# EAGLE board v3 (EAGLE 9.6.2)
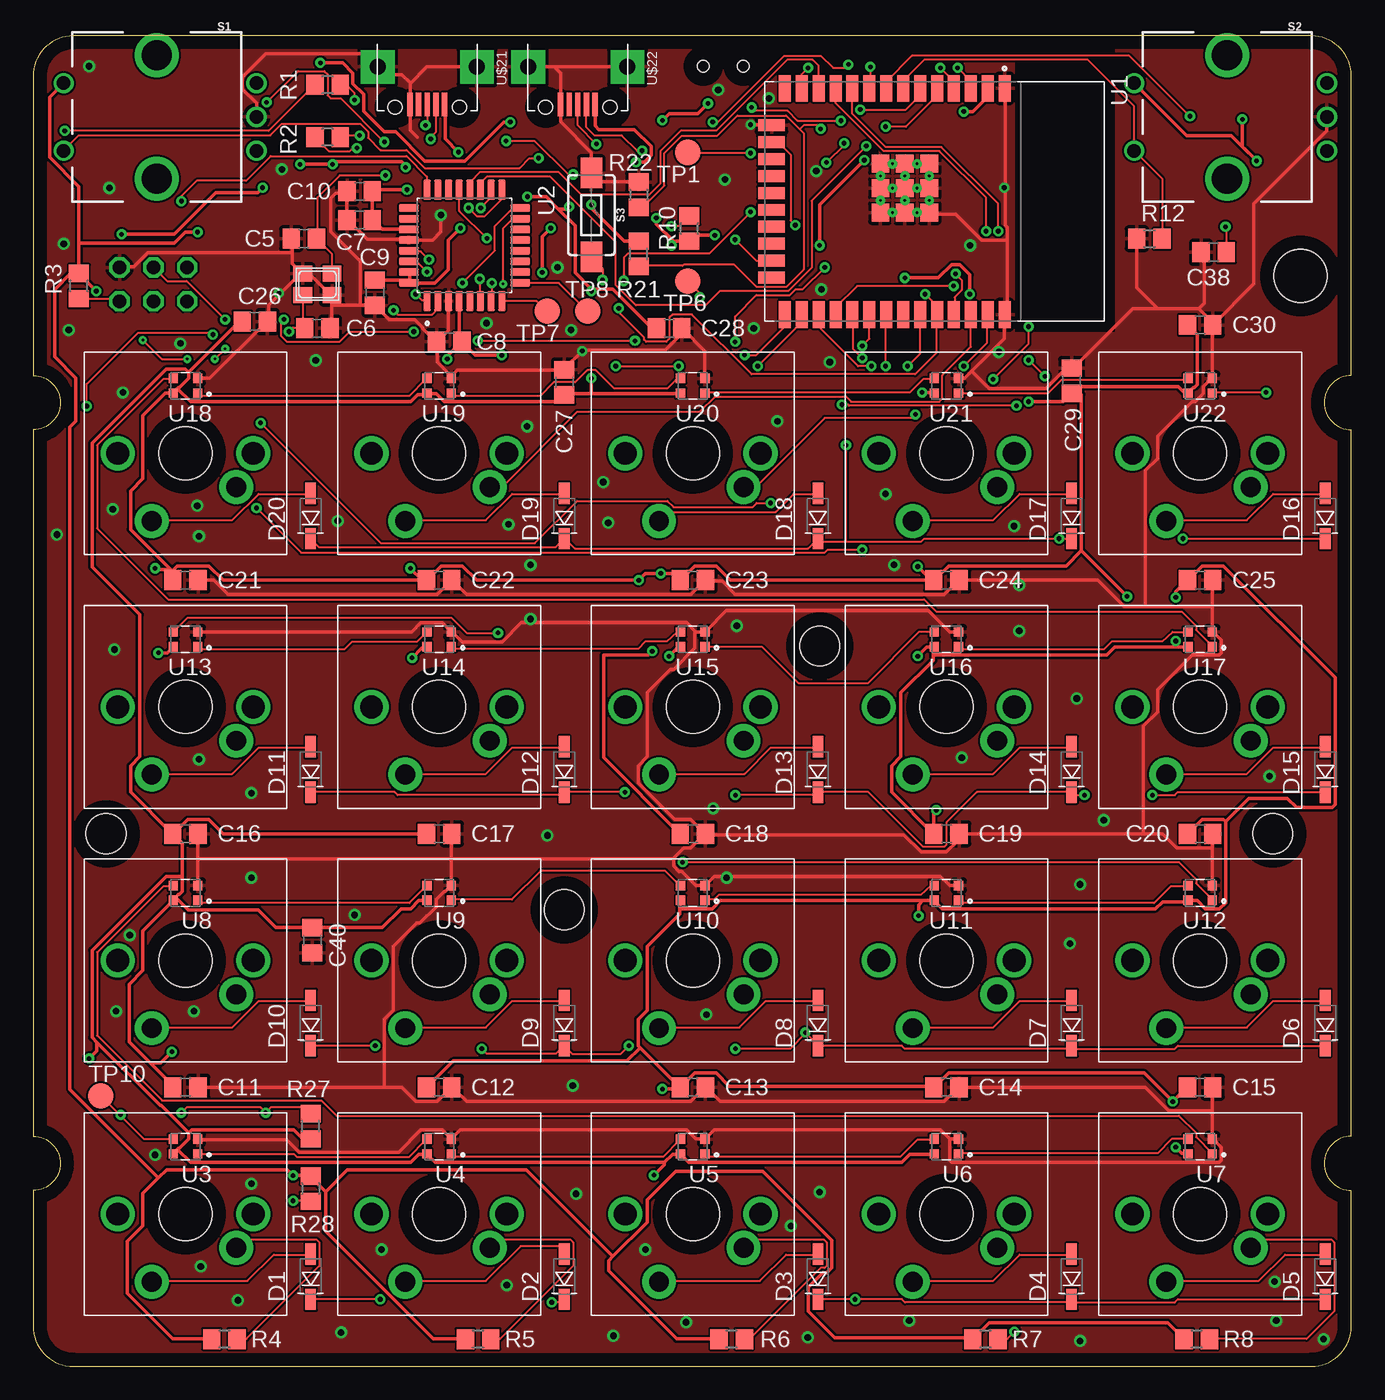
[diagram p1: board, top side]
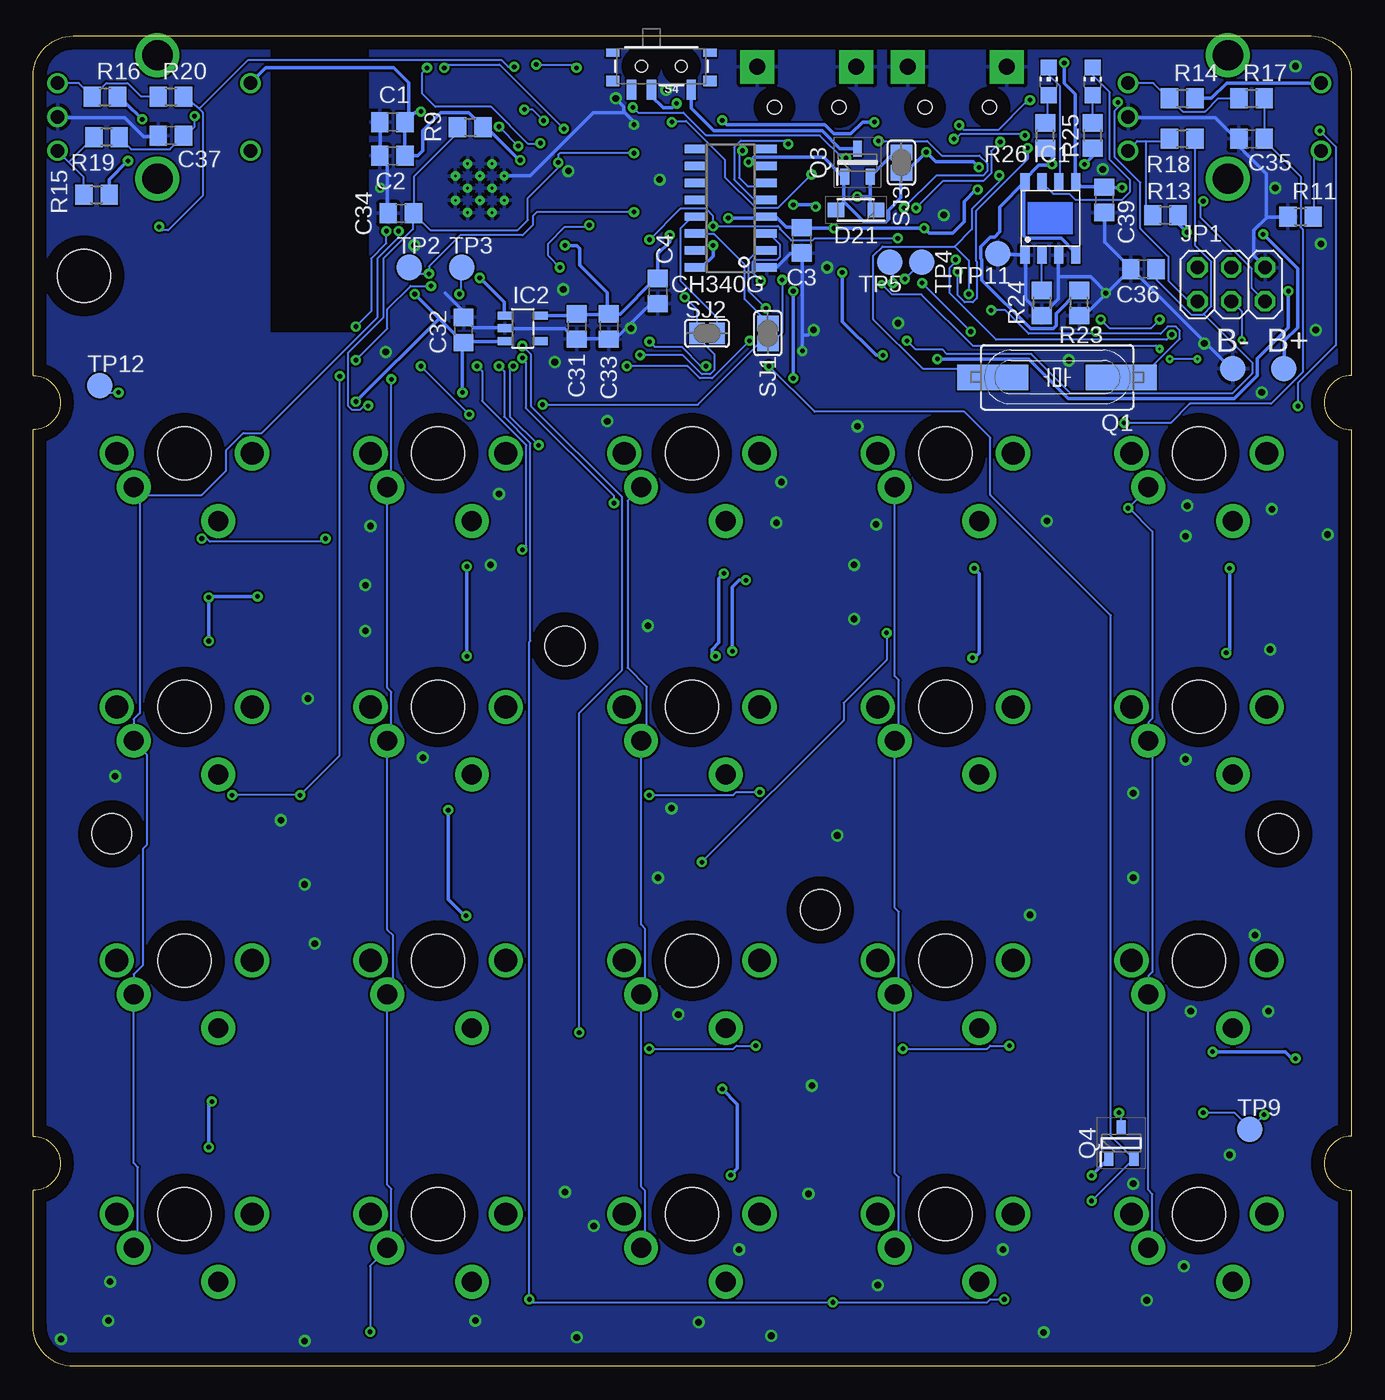
[diagram p2: board, bottom side, seen from below]

Size 98.98 x 99.94 mm. Coordinates in mm from the lower left corner, seen from the top.
Outline: 95.98,99.94 3,99.94 arc90 0,96.94 0,74.42 arc-180 0,70.36 0,17.27 arc-180 0,13.21 0,3 arc90 3,0 95.98,0 arc90 98.98,3 98.98,13.21 arc-180 98.98,17.27 98.98,70.36 arc-180 98.98,74.42 98.98,96.94 arc90 95.98,99.94
Copper layers (1*16): Top 0.035mm / dielectric 0.15mm / Bottom 0.035mm
Design rules "default *": minimum track width 6mil, minimum drill 0.2mm, track to track 6mil, track to pad 6mil, pad to pad 6mil, via to via 6mil, smd to smd 6mil, copper to edge 40mil, drill to drill 10mil, minimum pad ring 10mil, minimum via ring 8mil, stop-mask expansion 4mil, vias tented up to drill 0mil, thermal gap 10mil
Net classes: 1 pwr: width 0.279 mm
Holes 3 mm at 39.88,34.29 59.05,54.1 5.46,40.01 93.09,40.01
Holes 4 mm at 95.17,81.92

## Footprints (pad centres in the part's own frame; a part is rotated, then mirrored left to right if it is on the bottom)
C0805 = smd 1.3 x 1.5: 1 -0.95,0; 2 0.95,0
SOD123 = smd 1.6 x 0.8: 1 -1.7,0; 2 1.7,0
SODFL3616X98N = smd 1.24 x 1.12: 1 -1.5,0; 2 1.5,0
SOP-8 = smd 1.3 x 0.7: 1 -2.75,1.905; 2 -2.75,0.635; 3 -2.75,-0.635; 4 -2.75,-1.905; 5 2.75,-1.905; 6 2.75,-0.635; 7 2.75,0.635; 8 2.75,1.905
SOT23-5 = smd 0.6 x 1.05: 1 -0.95,-1.35; 2 0,-1.35; 3 0.95,-1.35; 4 0.95,1.35; 5 -0.95,1.35
2X03 = drill 1.016 octagon: 1 -2.54,-1.27; 2 -2.54,1.27; 3 0,-1.27; 4 0,1.27; 5 2.54,-1.27; 6 2.54,1.27
CHIP-LED0805 = smd 1.2 x 1.2: A 0,-1.05; C 0,1.05
HC49UP = smd 5.334 x 1.93: 1 -4.826,0; 2 4.826,0
NX3225 = smd 1.4 x 1.2: 1 -1.1,-0.8; 2 1.1,-0.8; 3 1.1,0.8; 4 -1.1,0.8
SOT96P240X120-3N = smd 1.2 x 0.65: 1 -1.05,0.96; 2 -1.05,-0.96; 3 1.05,0
SOT95P240X120-3N = smd 1 x 0.7: 1 -1.2,0.95; 2 -1.2,-0.95; 3 1.2,0
R0805 = smd 1.3 x 1.5: 1 -0.95,0; 2 0.95,0
ROTARY_ENC_PLAIN_2 = drill 1.016: A 7.493,-2.54; B 7.493,2.54; C 7.493,0; SW+ -6.985,2.54; SW- -6.985,-2.54 | drill 2.286: P$3 0,4.636; P$4 0,-4.636
TACTILE_SWITCH_SMD_6.0X3.5MM = smd 2.3 x 1.6: 1 -3.15,0; 2 3.15,0
SWITCH_SPST_SMD_A = smd 0.7 x 1.5: 1 -2.25,-1.75; 2 -0.75,-1.75; 3 2.25,-1.75 | smd 1 x 0.6: GND1 -3.65,1; GND3 3.65,1 | smd 1 x 0.8: GND2 -3.65,-1.1; GND4 3.65,-1.1 | hole 0.9: -1.5,0; 1.5,0
SJ = smd 1.168 x 1.6: 1 -0.762,0; 2 0.762,0
TP19R = smd 1.9 x 1.9: TP 0,0
MODULE_ESP32-WROOM-32D = smd 2 x 0.9: 1 -8.5,5.26; 2 -8.5,3.99; 3 -8.5,2.72; 4 -8.5,1.45; 5 -8.5,0.18; 6 -8.5,-1.09; 7 -8.5,-2.36; 8 -8.5,-3.63; 9 -8.5,-4.9; 10 -8.5,-6.17; 11 -8.5,-7.44; 12 -8.5,-8.71; 13 -8.5,-9.98; 14 -8.5,-11.25; 25 8.5,-11.25; 26 8.5,-9.98; 27 8.5,-8.71; 28 8.5,-7.44; 29 8.5,-6.17; 30 8.5,-4.9; 31 8.5,-3.63; 32 8.5,-2.36; 33 8.5,-1.09; 34 8.5,0.18; 35 8.5,1.45; 36 8.5,2.72; 37 8.5,3.99; 38 8.5,5.26 | smd 0.9 x 2: 15 -5.715,-12.25; 16 -4.445,-12.25; 17 -3.175,-12.25; 18 -1.905,-12.25; 19 -0.635,-12.25; 20 0.635,-12.25; 21 1.905,-12.25; 22 3.175,-12.25; 23 4.445,-12.25; 24 5.715,-12.25 | smd 1.33 x 1.33: 39_1 -2.835,-0.405; 39_2 -1,-0.405; 39_3 0.835,-0.405; 39_4 -2.835,-2.24; 39_5 -1,-2.24; 39_6 0.835,-2.24; 39_7 -2.835,-4.075; 39_8 -1,-4.075; 39_9 0.835,-4.075 | drill 0.2 pad 0.3: 39_10 -1.917,-0.405; 39_11 -0.083,-0.405; 39_12 -2.835,-1.323; 39_13 -1,-1.323; 39_14 0.835,-1.323; 39_15 -1.917,-2.24; 39_16 -0.083,-2.24; 39_17 -2.835,-3.158; 39_18 -1,-3.158; 39_19 0.835,-3.158; 39_20 -1.917,-4.075; 39_21 -0.083,-4.075
QFP80P900X900X120-32N = smd 1.49 x 0.55: 1 -4.17,2.8; 2 -4.17,2; 3 -4.17,1.2; 4 -4.17,0.4; 5 -4.17,-0.4; 6 -4.17,-1.2; 7 -4.17,-2; 8 -4.17,-2.8; 17 4.17,-2.8; 18 4.17,-2; 19 4.17,-1.2; 20 4.17,-0.4; 21 4.17,0.4; 22 4.17,1.2; 23 4.17,2; 24 4.17,2.8 | smd 0.55 x 1.49: 9 -2.8,-4.17; 10 -2,-4.17; 11 -1.2,-4.17; 12 -0.4,-4.17; 13 0.4,-4.17; 14 1.2,-4.17; 15 2,-4.17; 16 2.8,-4.17; 25 2.8,4.17; 26 2,4.17; 27 1.2,4.17; 28 0.4,4.17; 29 -0.4,4.17; 30 -1.2,4.17; 31 -2,4.17; 32 -2.8,4.17
WS2812-2020_LED_WS2812-2020 = smd 0.7 x 0.7: 1 -0.915,0.55; 2 -0.915,-0.55; 3 0.915,-0.55; 4 0.915,0.55
GATERON = drill 1.714 pad 1.93: P$3 -5.08,0; P$4 5.08,0 | drill 1.5 pad 2.54: SW1 -3.81,2.54; SW2 2.54,5.08 | hole 4: 0,0
BASE_MICROUSB_MICRO-USB = smd 0.4 x 1.75: 1 -1.3,4.525; 2 -0.65,4.525; 3 0,4.525; 4 0.65,4.525; 5 1.3,4.525 | drill 1.2 pad 2.54 square: GND1 -3.725,1.7; GND2 3.725,1.7 | hole 1.05: -2.425,4.73; 2.425,4.73
CH340G_SOIC16 = smd 0.635 x 1.524: 1 -4.445,-2.695; 2 -3.175,-2.695; 3 -1.905,-2.695; 4 -0.635,-2.695; 5 0.635,-2.695; 6 1.905,-2.695; 7 3.175,-2.695; 8 4.445,-2.695; 9 4.445,2.695; 10 3.175,2.695; 11 1.905,2.695; 12 0.635,2.695; 13 -0.635,2.695; 14 -1.905,2.695; 15 -3.175,2.695; 16 -4.445,2.695

## Placement (x,y rotation side)
C1  0.1uF  [C0805]  72.01,93.47 0 bottom
C2  1uF  [C0805]  72.01,90.93 0 bottom
C3  0.1uF  [C0805]  41.27,84.58 90 bottom
C4  1uF  [C0805]  52.07,80.77 90 bottom
C5  12pF  [C0805]  20.32,84.71 180 top
C6  12pF  [C0805]  21.34,77.98 0 top
C7  1uF  [C0805]  24.51,86.11 180 top
C8  0.1uF  [C0805]  31.24,76.96 0 top
C9  0.1uF  [C0805]  25.65,80.64 90 top
C10  1uF  [C0805]  24.51,88.27 0 top
C11  0.1uF  [C0805]  11.43,20.95 0 top
C12  0.1uF  [C0805]  30.48,20.95 0 top
C13  0.1uF  [C0805]  49.53,20.95 0 top
C14  0.1uF  [C0805]  68.58,20.95 0 top
C15  0.1uF  [C0805]  87.63,20.95 0 top
C16  0.1uF  [C0805]  11.43,40.01 0 top
C17  0.1uF  [C0805]  30.48,40.01 0 top
C18  0.1uF  [C0805]  49.53,40.01 0 top
C19  0.1uF  [C0805]  68.58,40.01 0 top
C20  0.1uF  [C0805]  87.63,40.01 0 top
C21  0.1uF  [C0805]  11.43,59.05 0 top
C22  0.1uF  [C0805]  30.48,59.05 0 top
C23  0.1uF  [C0805]  49.53,59.05 0 top
C24  0.1uF  [C0805]  68.58,59.05 0 top
C25  0.1uF  [C0805]  87.63,59.05 0 top
C26  0.1uF  [C0805]  16.64,78.49 0 top
C27  0.1uF  [C0805]  39.88,73.91 90 top
C28  0.1uF  [C0805]  47.75,77.98 0 top
C29  0.1uF  [C0805]  77.98,74.04 90 top
C30  0.1uF  [C0805]  87.63,78.23 0 top
C31  10uF  [C0805]  58.17,78.11 270 bottom
C32  10uF  [C0805]  66.67,77.85 90 bottom
C33  0.1uF  [C0805]  55.75,78.11 270 bottom
C34  1uF  [C0805]  71.37,86.61 0 bottom
C35  0.01uF  [C0805]  7.49,92.2 180 bottom
C36  0.01uF  [C0805]  15.62,82.42 180 bottom
C37  0.01uF  [C0805]  88.65,92.46 180 bottom
C38  0.01uF  [C0805]  88.65,83.69 180 top
C39  10uF  [C0805]  18.54,87.63 270 bottom
C40  0.1uF  [C0805]  20.95,32 270 top
D1  [SOD123]  20.83,6.73 90 top
D2  [SOD123]  39.88,6.73 90 top
D3  [SOD123]  58.93,6.73 90 top
D4  [SOD123]  77.98,6.73 90 top
D5  [SOD123]  97.03,6.73 90 top
D6  [SOD123]  97.03,25.78 90 top
D7  [SOD123]  77.98,25.78 90 top
D8  [SOD123]  58.93,25.78 90 top
D9  [SOD123]  39.88,25.78 90 top
D10  [SOD123]  20.83,25.78 90 top
D11  [SOD123]  20.83,44.83 90 top
D12  [SOD123]  39.88,44.83 90 top
D13  [SOD123]  58.93,44.83 90 top
D14  [SOD123]  77.98,44.83 90 top
D15  [SOD123]  97.03,44.83 90 top
D16  [SOD123]  97.03,63.88 90 top
D17  [SOD123]  77.98,63.88 90 top
D18  [SOD123]  58.93,63.88 90 top
D19  [SOD123]  39.88,63.88 90 top
D20  [SOD123]  20.83,63.88 90 top
D21  MBR120VLSFT1G  [SODFL3616X98N]  37.21,86.87 180 bottom
IC1  TP4056  [SOP-8]  22.61,86.23 90 bottom
IC2  ME6217C33M5G  [SOT23-5]  62.23,77.98 270 bottom
JP1  [2X03]  9.02,81.28 0 bottom
LED1  red  [CHIP-LED0805]  19.43,96.52 0 bottom
LED2  green  [CHIP-LED0805]  22.73,96.52 0 bottom
Q1  [HC49UP]  22.1,74.3 180 bottom
Q2  TAXM8M4RFDCET2T  [NX3225]  21.34,81.28 0 top
Q3  DMG3415U-7  [SOT96P240X120-3N]  37.08,90.42 90 bottom
Q4  BSS138  [SOT95P240X120-3N]  17.27,16.76 90 bottom
R1  22R  [R0805]  22.1,96.27 180 top
R2  22R  [R0805]  22.1,92.33 180 top
R3  10K  [R0805]  3.43,81.15 90 top
R4  10K  [R0805]  14.35,2.03 180 top
R5  10K  [R0805]  33.4,2.03 180 top
R6  10K  [R0805]  52.45,2.03 180 top
R7  10K  [R0805]  71.5,2.03 180 top
R8  10K  [R0805]  87.38,2.03 180 top
R9  10k  [R0805]  66.17,93.09 0 bottom
R10  10k  [R0805]  49.28,85.47 90 top
R11  10K  [R0805]  3.81,86.36 0 bottom
R12  10K  [R0805]  83.82,84.71 0 top
R13  10K  [R0805]  13.97,86.49 0 bottom
R14  10K  [R0805]  12.7,95.25 0 bottom
R15  10K  [R0805]  94.23,88.01 0 bottom
R16  10K  [R0805]  93.6,95.38 0 bottom
R17  10K  [R0805]  7.49,95.25 0 bottom
R18  10K  [R0805]  12.7,92.2 180 bottom
R19  10K  [R0805]  93.47,92.33 180 bottom
R20  10K  [R0805]  88.65,95.38 0 bottom
R21  47k  [R0805]  45.47,83.57 90 top
R22  47k  [R0805]  45.47,88.01 270 top
R23  100k  [R0805]  20.45,79.88 90 bottom
R24  2k  [R0805]  23.24,79.88 270 bottom
R25  1K  [R0805]  19.43,92.46 90 bottom
R26  1K  [R0805]  22.99,92.46 90 bottom
R27  10K  [R0805]  20.83,18.03 90 top
R28  10K  [R0805]  20.83,13.34 270 top
S1  ENCODER-SWITCH_ALI  [ROTARY_ENC_PLAIN_2]  9.27,93.85 0 top
S2  ENCODER-SWITCH_ALI  [ROTARY_ENC_PLAIN_2]  89.66,93.85 0 top
S3  MOMENTARY-SWITCH-SPST-SMD-6.0X3.5MM  [TACTILE_SWITCH_SMD_6.0X3.5MM]  41.91,86.49 270 top
S4  [SWITCH_SPST_SMD_A]  51.82,97.66 0 bottom
SJ1  [SJ]  43.81,77.6 90 bottom
SJ2  [SJ]  48.39,77.6 0 bottom
SJ3  [SJ]  33.78,90.42 90 bottom
TP1  TPTP19R  [TP19R]  49.15,91.19 180 top
TP2  TPTP19R  [TP19R]  70.74,82.55 0 bottom
TP3  TPTP19R  [TP19R]  66.8,82.55 0 bottom
TP4  TPTP19R  [TP19R]  32.26,82.93 270 bottom
TP5  TPTP19R  [TP19R]  34.67,82.93 180 bottom
TP6  TPTP19R  [TP19R]  49.15,81.53 0 top
TP7  TPTP19R  [TP19R]  38.61,79.25 180 top
TP8  TPTP19R  [TP19R]  41.66,79.25 0 top
TP9  TPTP19R  [TP19R]  7.62,17.78 0 bottom
TP10  TPTP19R  [TP19R]  5.08,20.32 0 top
TP11  TPTP19R  [TP19R]  26.54,83.57 180 bottom
TP12  TPTP19R  [TP19R]  93.98,73.66 0 bottom
TP13  TPTP19R  [TP19R]  5.08,74.93 0 bottom
TP14  TPTP19R  [TP19R]  8.89,74.93 0 bottom
U1  ESP32-WROOM-32D  [MODULE_ESP32-WROOM-32D]  67.69,87.5 270 top
U2  ATMEGA16U2-AU  [QFP80P900X900X120-32N]  32.38,84.2 90 top
U3  WS2812-2020_WS2812-2020  [WS2812-2020_LED_WS2812-2020]  11.43,16.51 180 top
U4  WS2812-2020_WS2812-2020  [WS2812-2020_LED_WS2812-2020]  30.48,16.51 180 top
U5  WS2812-2020_WS2812-2020  [WS2812-2020_LED_WS2812-2020]  49.53,16.51 180 top
U6  WS2812-2020_WS2812-2020  [WS2812-2020_LED_WS2812-2020]  68.58,16.51 180 top
U7  WS2812-2020_WS2812-2020  [WS2812-2020_LED_WS2812-2020]  87.63,16.51 180 top
U8  WS2812-2020_WS2812-2020  [WS2812-2020_LED_WS2812-2020]  11.43,35.56 180 top
U9  WS2812-2020_WS2812-2020  [WS2812-2020_LED_WS2812-2020]  30.48,35.56 180 top
U10  WS2812-2020_WS2812-2020  [WS2812-2020_LED_WS2812-2020]  49.53,35.56 180 top
U11  WS2812-2020_WS2812-2020  [WS2812-2020_LED_WS2812-2020]  68.58,35.56 180 top
U12  WS2812-2020_WS2812-2020  [WS2812-2020_LED_WS2812-2020]  87.63,35.56 180 top
U13  WS2812-2020_WS2812-2020  [WS2812-2020_LED_WS2812-2020]  11.43,54.61 180 top
U14  WS2812-2020_WS2812-2020  [WS2812-2020_LED_WS2812-2020]  30.48,54.61 180 top
U15  WS2812-2020_WS2812-2020  [WS2812-2020_LED_WS2812-2020]  49.53,54.61 180 top
U16  WS2812-2020_WS2812-2020  [WS2812-2020_LED_WS2812-2020]  68.58,54.61 180 top
U17  WS2812-2020_WS2812-2020  [WS2812-2020_LED_WS2812-2020]  87.63,54.61 180 top
U18  WS2812-2020_WS2812-2020  [WS2812-2020_LED_WS2812-2020]  11.43,73.66 180 top
U19  WS2812-2020_WS2812-2020  [WS2812-2020_LED_WS2812-2020]  30.48,73.66 180 top
U20  WS2812-2020_WS2812-2020  [WS2812-2020_LED_WS2812-2020]  49.53,73.66 180 top
U21  WS2812-2020_WS2812-2020  [WS2812-2020_LED_WS2812-2020]  68.58,73.66 180 top
U22  WS2812-2020_WS2812-2020  [WS2812-2020_LED_WS2812-2020]  87.63,73.66 180 top
U$1  GATERON  [GATERON]  11.43,11.43 180 top
U$2  GATERON  [GATERON]  30.48,11.43 180 top
U$3  GATERON  [GATERON]  49.53,11.43 180 top
U$4  GATERON  [GATERON]  68.58,11.43 180 top
U$5  GATERON  [GATERON]  87.63,11.43 180 top
U$6  GATERON  [GATERON]  11.43,30.48 180 top
U$7  GATERON  [GATERON]  30.48,30.48 180 top
U$8  GATERON  [GATERON]  49.53,30.48 180 top
U$9  GATERON  [GATERON]  68.58,30.48 180 top
U$10  GATERON  [GATERON]  87.63,30.48 180 top
U$11  GATERON  [GATERON]  11.43,49.53 180 top
U$12  GATERON  [GATERON]  30.48,49.53 180 top
U$13  GATERON  [GATERON]  49.53,49.53 180 top
U$14  GATERON  [GATERON]  68.58,49.53 180 top
U$15  GATERON  [GATERON]  87.63,49.53 180 top
U$16  GATERON  [GATERON]  11.43,68.58 180 top
U$17  GATERON  [GATERON]  30.48,68.58 180 top
U$18  GATERON  [GATERON]  49.53,68.58 180 top
U$19  GATERON  [GATERON]  68.58,68.58 180 top
U$20  GATERON  [GATERON]  87.63,68.58 180 top
U$21  BASE_MICROUSB_MICRO-USB  [BASE_MICROUSB_MICRO-USB]  29.59,99.31 180 top
U$22  BASE_MICROUSB_MICRO-USB  [BASE_MICROUSB_MICRO-USB]  40.89,99.31 180 top
U$23  CH340G_CH340G  [CH340G_SOIC16]  46.61,87 90 bottom

## Tracks (layer width: path | path; a pad name or v marks a point on that pad's centre or on a via)
3V3  (via drill 0.35)
  Top 0.279: R8.2 86.41,2.06 85.19,3.28 71.78,3.28 70.56,2.06 R7.2 70.48,2.13 60.2,2.13 58.22,4.12 58.22,5.94 59.28,7.01 59.59,7.01 59.97,7.39 59.97,9.45 54.79,14.63 48.23,14.63 46.1,12.5 46.1,10.82 43.52,8.24 | 9.4,14.15 10.01,14.76 19.07,14.76 v19.51,14.33 20.8,14.33 R28.1 20.88,14.17 21.95,13.11 | 9.4,14.15 8.23,12.98 8.23,10.54 7.06,9.37 7.06,5.46 10.46,2.06 13.34,2.06 R4.2 | 21.95,13.11 21.95,10.13 30.02,2.06 32.38,2.06 R5.2 | 43.52,8.24 37.01,14.76 23.6,14.76 21.95,13.11 | R6.2 51.44,2.06 48.31,2.06 43.2,7.16 43.2,7.92 43.52,8.24 | v69.88,94.26 70.56,94.26 71.63,95.33 71.63,95.94 U1.2 | S2.SW+ 86.61,92.46 89.97,92.46 v91.87,90.55 90.81,91.62 v90.81,93.67 | 3.43,84.35 3.43,88.62 1.22,90.83 1.22,95.33 S1.SW+ | 3.43,84.35 R3.2 | v12.34,85.19 11.43,85.19 10.59,84.35 3.43,84.35 | U2.27 28.19,85.42 26.21,85.42 25.53,86.11 C7.1 25.45,86.18 25.45,88.24 C10.2 25.59,88.39 v28.07,88.39 | 32.16,76.96 32,77.11 32,80.01 U2.4 31.93,80.16 | 32.16,76.96 C8.2 32.08,76.89 31.09,75.89 v31.09,75.67 | U2.32 28.27,81.46 28.27,82.14 U2.31 | C9.2 25.68,81.61 28.19,81.61 U2.32 | U2.32 28.35,81.38 30.17,81.38 31.17,82.38 31.17,84.58 v32.08,85.5 | v46.79,86.26 46.79,85.8 48.08,84.51 v47.93,84.2 48.23,84.51 49.23,84.51 R10.1 49.72,84.96 v51.18,84.96 | v4.72,80.77 3.5,81.99 R3.2 | v62.41,90.6 59.05,87.25 v59.05,84.2 | 9.4,14.15 2.74,20.8 2.74,70.54 3.2,70.99 3.2,74.24 1.6,75.84 1.6,80.87 2.83,82.1 R3.2 | v38.86,85.5 38.23,84.86 v38.23,82.17 | v35.18,75.95 33.17,75.95 32.16,76.96
  Bottom 0.279: v19.51,14.33 18.29,15.54 Q4.1 | 71.02,93.5 C1.2 | C1.2 71.09,93.34 71.09,90.98 C2.2 70.1,90.93 69.72,91.31 69.72,92.84 68.38,94.18 66.29,94.18 65.23,93.12 R9.2 65.15,93.04 64.92,93.04 62.48,90.6 v62.41,90.6 | v69.88,94.26 69.88,94.18 70.35,94.18 C1.2 | R15.2 93.28,89.14 v91.87,90.55 | v90.81,93.67 92.03,94.9 R16.2 | C1.2 70.81,93.73 70.81,96.43 71.91,97.54 81.53,97.54 S2.SW+ | v12.34,85.19 12.95,85.8 12.95,86.49 R13.2 | R14.2 10.52,95.25 9.37,96.39 S1.SW+ | IC2.5 60.81,78.94 58.29,78.94 58.22,79.02 C31.1 58.06,79.02 55.78,79.02 C33.1 | C33.1 54.91,79.06 52.3,81.66 52.07,81.66 C4.2 52.07,83.57 51.18,84.45 v51.18,84.96 | v47.93,84.2 47.93,83.41 48.74,82.6 49.3,82.6 U$23.16 | v46.79,86.26 43.97,86.26 U$23.4 43.89,86.33 43.2,86.33 42.44,85.57 41.3,85.57 C3.2 41.15,85.5 v38.86,85.5 v32.08,85.5 31.7,85.11 29.95,85.11 29.08,85.98 29.08,87.5 28.19,88.39 v28.07,88.39 | v4.72,80.77 4.72,78.03 7.06,75.69 7.06,74.42 8.79,72.69 21.26,72.69 24.23,75.67 v31.09,75.67 | v59.05,84.2 58.17,84.2 57.94,83.97 57.94,82.7 55.88,80.64 55.88,79.18 C33.1 | v38.23,82.17 38.23,78.49 35.69,75.95 v35.18,75.95
ATM_CLK  (via drill 0.2)
  Top 0.152: v35.28,81.31 35.28,85.5 35.97,86.18 36.5,86.18 U2.15 | v13.64,75.67 v14.4,76.43 | v11.56,75.67 9.65,75.67 v8.23,77.09
  Bottom 0.152: v35.28,81.31 34.49,80.52 32.28,80.52 28.45,76.68 14.66,76.68 v14.4,76.43 | v11.56,75.67 v13.64,75.67 | v8.23,77.09 8.23,79.25 8.99,80.01 JP1.3
ATM_MISO  (via drill 0.35)
  Top 0.152: v32.69,87.02 33.3,86.41 33.91,86.41 35.13,87.63 35.13,88.32 U2.17 | v26.36,91.97 23.09,95.25 22.33,95.25 22.1,95.48 22.1,97.08 21.87,97.31 19.89,97.31 v17.53,94.94
  Bottom 0.152: v32.69,87.02 30.66,89.05 27.61,89.05 27.05,89.61 27.05,91.29 v26.36,91.97 | v17.53,94.94 17.53,94.56 17.75,94.34 17.75,90.83 15.85,88.92 15.85,85.47 13.74,83.36 13.74,81.56 12.19,80.01 JP1.1
ATM_MOSI  (via drill 0.35)
  Top 0.152: v32.23,81.38 34.67,83.82 34.67,85.65 35.97,86.94 36.5,86.94 U2.16 | v28.57,77.72 23.77,77.72 23.01,76.96 19.05,76.96 18.59,77.42 18.59,78.41 v18.82,78.64 | v14.4,78.64 11.51,81.53 10.06,81.53 9.07,82.53 JP1.4
  Bottom 0.152: v28.57,77.72 v32.23,81.38 | v14.4,78.64 15.04,78 18.19,78 v18.82,78.64
ATM_RST  (via drill 0.35)
  Top 0.152: v11.12,87.53 11.12,87.91 12.27,89.05 15.98,89.05 17.83,90.91 28.04,90.91 29.57,89.38 29.57,88.39 U2.24 | JP1.5 6.33,80.16 3.43,80.16 R3.1
  Bottom 0.152: v11.12,87.53 11.33,87.33 11.33,86.31 7.47,82.45 7.47,81 JP1.5
CH_DTR
  Bottom 0.152: SJ2.2 47.62,78.79 50.37,81.53 50.37,85.5 49.53,86.33 49.38,86.33 U$23.13
CH_RTS
  Bottom 0.152: U$23.14 49.3,85.04 47.85,85.04 45.57,82.75 45.57,80.16 43.81,78.41 SJ1.2
ENC1_A  (via drill 0.35)
  Top 0.152: v54.41,75.13 57.68,78.41 57.68,78.94 U1.26 | v33.38,77.04 v45.19,77.04
  Bottom 0.152: 11.09,79.06 11.12,79.02 12.04,79.02 14.63,81.61 14.63,82.37 C36.1 | 11.09,79.06 10.52,79.63 10.52,82.98 11.73,84.2 11.73,92.18 R18.1 | v54.41,75.13 49.84,75.13 48.92,74.22 48.01,74.22 v45.19,77.04 | v33.38,77.04 32.74,76.4 30.73,76.4 30.38,76.05 24.03,76.05 21.06,73.08 8.94,73.08 7.44,74.57 7.44,75.41 11.09,79.06
ENC1_B  (via drill 0.35)
  Top 0.152: v62.26,75.74 61.57,76.43 61.57,78.94 U1.29 | v55.37,64.85 54.33,64.85 54.03,64.54 48.08,64.54 47.62,65 40.84,65 37.67,61.82 26.11,61.82 v17.07,70.87
  Bottom 0.152: R17.2 6.55,95.25 6.55,92.25 C35.1 6.49,92.06 3.81,89.38 3.81,85.57 3.66,85.42 3.66,74.68 6.02,72.31 12.12,72.31 13.56,70.87 v17.07,70.87 | v62.26,75.74 62,75.49 62,71.98 55.37,65.35 v55.37,64.85
ENC2_A  (via drill 0.35)
  Top 0.152: v86.87,93.9 82.32,98.45 65.99,98.45 64.08,96.55 64.08,96.01 U1.8
  Bottom 0.152: R19.1 92.51,92.28 91.64,91.42 88.72,91.42 87.86,92.28 87.73,92.28 C37.1 87.42,92.56 86.87,93.12 v86.87,93.9
ENC2_B  (via drill 0.35)
  Top 0.152: v62.87,97.61 62.87,96.01 U1.9 | v89.53,85.6 89.6,85.54 C38.1
  Bottom 0.152: 86.51,94.46 86.53,94.48 R20.2 | 86.51,94.46 86.26,94.21 86.26,87.94 88.85,85.34 89.28,85.34 v89.53,85.6 | v62.87,97.61 63.32,97.61 63.86,98.15 82.83,98.15 86.51,94.46
ENCBT1  (via drill 0.35)
  Top 0.152: v62.1,94.41 65.53,94.41 66.6,95.48 66.6,95.94 U1.6 | v60.66,93.57 57.38,93.57 56.64,94.31 54.2,94.31 v53.95,94.56 | v37.95,90.75 37.26,90.75 36.52,90.02 29.39,90.02 28.04,91.36 26.06,91.36 25.15,92.28 25.15,92.73 24.54,93.34 18.67,93.34 17.8,92.48 3.4,92.48 2.29,91.36 S1.SW-
  Bottom 0.152: R11.2 2.82,86.41 2.82,90.75 2.29,91.29 S1.SW- | v62.1,94.41 61.49,94.41 v60.66,93.57 | v53.95,94.56 53.57,94.18 50.16,94.18 48.44,92.46 39.9,92.46 38.2,90.75 v37.95,90.75
ENCBT2
  Top 0.152: U1.7 65.38,96.01 65.38,96.62 66.9,98.15 79.2,98.15 82.68,94.67 S2.SW- 84.77,89.22 R12.2
  Bottom 0.152: 82.68,91.29 S2.SW-
ESP_BOOT  (via drill 0.35)
  Top 0.152: v50.06,80.31 50.06,80.62 TP6.TP | U1.25 56.44,78.11 54.3,75.97 v53.42,75.97
  Bottom 0.152: v50.06,80.31 49.15,79.4 SJ2.1 49.15,77.34 47.85,76.05 47.85,74.83 48.16,74.52 48.77,74.52 50.22,75.97 v53.42,75.97
ESPRX  (via drill 0.35)
  Top 0.152: v43.97,79.48 43.97,79.17 45.87,77.27 45.87,77.11 46.02,76.96 47.55,76.96 47.78,77.19 47.78,78.79 48.01,79.02 49.45,79.02 53.95,74.52 66.22,74.52 67.82,76.12 67.82,78.94 U1.34 67.82,79.02 67.82,79.7 v66.98,80.54
  Bottom 0.152: U$23.2 44.58,83.82 45.26,83.13 45.26,80.77 v43.97,79.48 | v66.98,80.54 66.83,80.7 66.83,82.53 TP3.TP
ESPTX  (via drill 0.35)
  Top 0.152: v44.35,81.53 44.35,83.29 44.65,83.59 50.75,83.59 v53.87,86.72 | v69.27,82.07 69.72,81.61 69.72,80.85 69.19,80.31 69.19,79.02 U1.35
  Bottom 0.152: v44.35,81.53 44.96,82.14 44.96,82.98 44.81,83.13 43.13,83.13 42.9,83.36 42.9,84.28 43.66,85.04 43.89,85.04 U$23.3 | v53.87,86.72 61.16,86.72 61.47,86.41 61.47,85.72 62.23,84.96 66.93,84.96 69.27,82.63 v69.27,82.07 70.1,82.07 70.64,82.6 TP2.TP 70.71,82.6 70.71,83.21
GND  (via drill 0.35, 0.5)
  Top 0.279: U$21.5 28.29,96.42 27.69,97.03 26.45,97.03 U$21.GND2 25,98.6 17.45,98.6 15.7,96.85 15.7,95.94 16.76,94.87 S1.C | U13.2 12.42,55.17 28.42,55.17 29.11,55.85 30.71,55.85 U14.2 31.47,55.17 32.23,54.41 35.2,54.41 36.65,55.85 49.07,55.85 49.76,55.17 | 49.76,55.17 U15.2 50.52,55.24 52.05,56.77 67.21,56.77 68.81,55.17 U16.2 | 12.34,38.1 12.34,40.01 C16.2 | 12.34,38.1 U8.2 | 31.39,38.1 31.39,40.01 C17.2 | 31.39,38.1 U9.2 31.32,36.04 30.94,35.66 30.86,35.66 30.25,35.05 30.25,34.52 29.03,33.3 28.8,33.3 27.05,31.55 27.05,26.75 26.36,26.06 26.36,20.95 | 31.39,38.1 12.34,38.1 | 48.08,38.1 48.08,38.18 48.84,38.94 49.38,38.94 50.44,40.01 C18.2 | 48.08,38.1 48.08,37.57 48.46,37.19 48.69,37.19 49.76,36.12 U10.2 50.52,36.2 51.13,36.8 68.12,36.8 68.81,36.12 U11.2 | 48.08,38.1 31.39,38.1 | 49.76,55.17 49.68,55.09 49.68,53.95 48.08,52.35 47.85,52.35 46.1,50.6 46.1,45.8 45.41,45.11 45.41,43.81 48.16,41.07 49.38,41.07 50.37,40.08 C18.2 | U3.2 12.42,16.99 19.05,16.99 19.96,16.08 27.43,16.08 29.11,17.75 30.71,17.75 U4.2 31.47,17.14 32.08,17.75 49.07,17.75 49.76,17.07 U5.2 50.52,17.14 51.13,17.75 68.12,17.75 68.81,17.07 | 68.81,17.07 U6.2 | 88.54,19.2 88.54,20.95 C15.2 | 88.54,19.2 U7.2 88.62,17.07 89.23,16.46 89.23,15.47 89.08,15.32 68.96,15.32 68.81,15.47 68.81,17.07 | 88.54,19.2 85.27,19.2 83.52,20.95 C14.2 69.42,20.88 68.43,19.89 51.59,19.89 50.6,20.88 C13.2 50.44,20.95 49.38,19.89 32.54,19.89 31.55,20.88 C12.2 31.39,20.95 30.33,19.89 28.73,19.89 27.66,20.95 26.36,20.95 | 26.36,20.95 C11.2 | C21.2 13.56,59.05 14.63,57.99 30.33,57.99 31.39,59.05 C22.2 31.55,58.98 32.54,57.99 49.38,57.99 50.44,59.05 C23.2 50.6,58.98 51.74,58.98 52.73,57.99 68.43,57.99 69.42,58.98 C24.2 79.93,59.05 81.92,57.07 83.52,57.07
  Top 0.279: 88.54,38.94 88.54,40.01 C20.2 | 88.54,38.94 U12.2 | 83.36,40.01 84.81,40.01 85.88,38.94 88.54,38.94 | 83.36,40.01 C19.2 69.42,39.93 69.42,39.47 68.58,38.63 66.67,38.63 65.38,39.93 50.6,39.93 C18.2 | 88.54,57.07 88.54,59.05 C25.2 | 88.54,57.07 U17.2 88.62,55.17 89.23,54.56 89.23,53.57 89.08,53.42 87.02,53.42 84.43,50.83 84.43,49.15 83.36,48.08 83.36,40.01 | 88.54,57.07 83.52,57.07 | U20.2 50.44,76.28 48.77,77.95 C28.2 48.84,77.72 47.47,76.35 41.3,76.35 v41.22,76.28 39.93,74.98 C27.2 39.85,74.83 31.85,74.83 31.47,74.45 U19.2 31.39,74.37 30.33,75.44 30.33,76.96 C8.1 | U2.3 31.17,80.01 31.17,77.8 30.4,77.04 C8.1 | U18.2 12.42,74.22 13.26,74.22 17.53,78.49 C26.2 17.68,78.56 17.68,79.7 18.52,80.54 | 23.55,88.14 23.55,86.18 C7.2 23.62,86.11 25.07,84.66 28.19,84.66 U2.28 29.99,84.6 30.61,85.22 v30.61,86.49 | 23.55,88.14 23.55,88.24 C10.1 | 22.4,79.7 22.4,78.11 22.33,78.03 C6.2 | 22.4,79.7 22.4,80.47 Q2.2 22.33,80.47 20.73,82.07 20.27,82.07 Q2.4 | 22.4,79.7 24.54,79.7 | 24.54,79.7 25.6,79.7 C9.1 25.76,79.63 26.75,78.64 28.65,78.64 29.26,78.03 29.26,77.95 30.18,77.04 C8.1 | 19.43,83.67 19.43,82.83 20.12,82.14 Q2.4 | 19.43,83.67 19.43,84.66 C5.2 | 18.52,80.54 20.04,82.07 Q2.4 | 19.43,83.67 8.61,83.67 7.54,82.6 6.48,82.6 JP1.6 | v18.44,80.62 18.52,80.54 | R22.1 45.41,89 42.52,89 41.91,89.61 S3.1 41.91,91.19 39.59,93.5 U$22.5 39.59,97.14 39.12,97.61 | v53.87,93.27 55.4,93.27 U1.15 | 33.4,97.61 U$21.GND1 33.25,97.61 29.54,97.61 28.29,96.36 U$21.5 | U1.39_5 65.46,88.47 65.46,87.71 U1.39_16 65.46,87.55 65.46,86.72 U1.39_6 65.53,86.64 66.29,86.64 U1.39_14 | U1.39_13 66.29,88.54 65.53,88.54 U1.39_5
  Top 0.279: U1.39_8 63.63,88.47 63.63,87.71 U1.39_21 63.63,87.55 63.63,86.72 U1.39_9 63.7,86.64 64.47,86.64 U1.39_19 | U1.39_18 64.47,88.54 63.7,88.54 U1.39_8 | U1.39_4 65.38,90.37 64.62,90.37 U1.39_17 64.47,90.37 63.63,90.37 U1.39_7 63.63,90.22 63.63,89.46 U1.39_20 63.63,89.31 63.63,88.62 U1.39_8 | U1.39_4 65.46,90.22 65.46,89.46 U1.39_15 65.46,89.31 65.46,88.62 U1.39_5 | U1.39_4 65.53,90.37 66.29,90.37 U1.39_12 66.45,90.22 67.21,90.22 U1.39_1 67.28,90.3 67.28,89.46 U1.39_10 67.28,89.31 67.28,88.62 U1.39_2 67.28,88.47 67.28,87.71 U1.39_11 67.28,87.55 67.28,86.72 U1.39_3 67.36,86.56 69.27,86.56 71.25,84.58 73.15,84.58 | C30.2 88.54,78.18 U22.2 88.47,74.22 87.86,73.61 87.86,73.08 87.25,72.47 87.02,72.47 84.43,69.88 84.43,68.2 83.52,67.28 83.52,57.07 | 70.48,74.75 72.92,77.19 72.92,78.94 U1.38 73,79.1 73.15,79.25 73.15,84.58 | 70.48,74.75 69.95,74.22 69.57,74.22 U21.2 | 70.48,74.75 71.78,73.46 76.05,73.46 77.57,74.98 77.95,74.98 C29.2 78.11,74.98 82.58,79.45 84.45,79.45 | 73,88.54 73,85.72 73.15,85.57 73.15,84.58 | 73,88.54 73,95.94 U1.1 | C30.2 88.58,78.4 87.53,79.45 | 84.45,79.45 87.53,79.45 | S2.C 97.16,92.81 91.67,87.33 91.67,81.32 C30.2 | v72.92,88.54 73,88.54 | U$21.5 28.29,92.87 28.83,92.33 | U$22.GND1 39.12,97.61 | 39.12,97.61 U$22.GND2 | 23.55,88.14 22.73,88.14 22.35,87.76 22.35,85.22 24.54,83.03 24.54,79.7 | C38.2 87.95,83.44 87.95,79.87 87.53,79.45 | R12.1 82.87,81.04 84.45,79.45
  Bottom 0.279: TP11.TP 26.52,83.52 24.54,83.52 IC1.1 24.46,83.36 24.46,80.16 23.32,79.02 R24.2 23.24,78.94 22.02,80.16 22.02,81.84 | 22.02,81.84 22.02,83.44 IC1.3 | 18.36,80.62 16.61,82.37 C36.2 | 18.36,80.62 18.4,80.58 | 18.4,80.58 20.04,78.94 20.42,78.94 R23.1 | C39.2 18.52,86.64 18.52,84.43 16.61,82.53 C36.2 | TP14.TP 8.91,74.98 9.07,74.98 16.46,82.37 C36.2 | 22.02,81.84 19.58,81.84 18.36,80.62 | U$23.1 43.89,82.6 43.13,82.6 42.14,83.59 41.3,83.59 C3.1 41.22,83.52 41.22,77.47 | v41.22,76.28 41.22,77.47 | 6.33,86.33 4.8,86.33 R11.1 | 6.33,86.33 7.32,85.34 7.32,83.44 6.48,82.6 JP1.6 | 6.33,86.33 6.4,86.41 6.4,89.59 8.38,91.57 8.38,92.18 C35.2 8.82,92.41 10.21,93.8 16.76,93.8 S1.C | v18.44,80.62 18.4,80.58 | v53.87,93.27 53.87,93.5 54.63,94.26 | 72.39,88.54 72.39,90.37 72.92,90.91 C2.1 72.92,91.06 72.92,93.42 C1.1 | 72.39,88.54 72.39,86.64 C34.1 | C4.1 52.07,80.37 55.1,77.34 C33.2 55.78,77.19 58.14,77.19 C31.2 58.29,77.19 59.05,77.95 63.48,77.95 IC2.2 63.63,78.03 65.91,78.03 C32.2 66.75,78.87 66.75,79.32 68.05,80.62 | C37.2 89.66,92.35 90.68,92.35 92.13,93.8 97.16,93.8 S2.C | 66.37,86.64 U1.39_14 | v72.92,88.54 72.39,88.54 | 54.63,94.26 54.71,94.18 56.92,94.18 61.65,89.46 63.55,89.46 U1.39_20 | 45.38,96.85 U$22.GND1 | v55.24,95.25 54.63,94.64 54.63,94.26 | 41.22,77.47 40.77,77.47 v40.39,77.85
  other vias: 37.08,70.61 42.8,66.42 43.18,63.37 6.1,53.85 1.78,62.48 12.45,62.36 12.32,64.64 5.97,64.39 15.37,4.95 26.16,8.76 23.11,2.54 43.56,2.29 40.77,12.95 65.79,3.43 58.17,2.16 78.61,1.91 93.34,3.43 93.22,6.35 69.72,45.72 50.55,26.42 64.01,65.53 55.88,70.99 64.64,60.2 35.69,63.25 39.37,82.55 51.94,89.15 58.8,89.79 92.84,44.32 16.38,36.7 21.21,75.56 72.52,76.2 45.97,8.76 35.56,6.1 49.02,3.3 12.57,7.49 6.22,26.67 12.06,26.67 16.38,13.72 73.66,63.12 59.82,75.44 54.1,77.98 34.04,78.36 56.9,10.54 22.86,63.5 12.45,45.59 7.24,32.38 9.14,15.88 6.73,73.15 2.67,77.85 18.67,89.92 5.71,88.52 2.29,84.33 51.44,95.89 4.19,97.66 59.18,80.9 96.9,2.03 11.05,76.83 24.13,33.91 37.34,60.2 37.34,56.13 16.38,43.05 38.61,39.88 40.51,21.08 59.05,13.08 77.85,31.75 78.61,36.2 80.39,41.02 78.36,50.16 51.05,41.91 52.07,36.7 52.83,55.63 74.04,55.24 74.04,58.67 70.36,84.2
  pour Top: -11.43,110.62 -11.43,-10.03 113.03,-10.03 113.03,110.62 81.28,110.62 81.28,77.6 73.66,77.6 73.66,110.62
  pour Bottom: -16.51,115.7 -16.51,-15.11 119.38,-15.11 119.38,115.7 81.28,115.7 81.28,77.6 73.66,77.6 73.66,115.7
I_CS  (via drill 0.35)
  Top 0.152: v34.06,84.73 32,86.79 32,88.32 U2.21 | v47.93,85.65 48.46,85.65 49.23,86.41 R10.2 | U1.23 54.28,83.06 v52.7,84.63
  Bottom 0.152: v34.06,84.73 40.31,84.73 40.46,84.58 42.06,84.58 42.9,85.42 42.9,85.5 43.05,85.65 v47.93,85.65 47.93,86.41 48.46,86.94 50.39,86.94 v52.7,84.63
I_MISO  (via drill 0.35)
  Top 0.152: v62.56,91.67 58.45,87.55 58.45,82.53 56.69,80.77 51.56,80.77 50.49,79.7 45.26,79.7 43.74,81.23 43.74,84.45 38.81,89.38 34.06,89.38 33.6,88.92 33.6,88.39 U2.19 | v64.01,93.12 65.53,93.12 67.82,95.4 67.82,95.94 U1.5
  Bottom 0.152: v64.01,93.12 v62.56,91.67
I_MOSI  (via drill 0.35)
  Top 0.152: v33.6,87.02 34.37,87.78 34.37,88.32 U2.18 | v35.51,92.05 37.64,92.05 40.16,89.53 v40.54,89.53 | v58.19,97.54 57.68,97.03 57.68,96.01 U1.13 | v61.21,97.79 60.96,97.54 60.07,97.54 59.16,98.45 56.39,98.45 51.41,93.47 v51.03,93.47
  Bottom 0.152: v33.6,87.02 31.17,89.46 27.66,89.46 27.36,89.76 27.36,90.37 27.94,90.96 30.76,90.96 31.85,92.05 v35.51,92.05 | v40.54,89.53 43.05,87.02 44.73,87.02 47.04,89.33 47.04,90.63 49.96,93.55 50.95,93.55 v51.03,93.47 | v61.21,97.79 58.45,97.79 v58.19,97.54
I_SCK
  Top 0.152: U2.20 32.84,88.39 32.84,89 33.53,89.69 39.47,89.69 41.15,88.01 46.25,88.01 47.09,88.85 47.09,91.29 48.64,92.84 51.31,92.84 56.62,98.15 58.52,98.15 58.98,97.69 58.98,96.01 U1.12
M_1  (via drill 0.35)
  Top 0.152: D20.1 21.49,61.52 39.19,61.52 39.85,62.18 D19.1 39.93,62.18 40.66,61.44 58.19,61.44 D18.1 58.98,62.18 59.21,61.95 61.04,61.95 | 61.04,61.95 66.67,61.95 66.9,62.18 v77.04,62.18 77.95,62.18 D17.1 | v86.33,62.18 97,62.18 D16.1 | v62.94,75.13 61.95,75.13 59.05,78.03 59.05,78.94 U1.27 | 61.04,61.95 v61.04,69.19
  Bottom 0.152: v86.33,62.18 85.95,62.18 85.72,61.95 77.27,61.95 v77.04,62.18 | v62.94,75.13 63.2,74.88 63.2,71.35 v61.04,69.19
M_2  (via drill 0.35)
  Top 0.152: D11.1 20.88,43.13 27.13,43.13 27.36,42.9 39.62,42.9 39.85,43.13 D12.1 39.93,43.13 v44.42,43.13 | v84.05,42.9 85.72,42.9 85.95,43.13 97,43.13 D15.1 | v78.94,42.9 78.26,42.9 78.03,43.13 D14.1 77.95,43.13 70.87,43.13 68.58,40.84 68.58,39.17 68.43,39.01 66.83,39.01 62.71,43.13 58.98,43.13 D13.1 58.9,43.13 58.67,42.9 v52.73,42.9 | v69.11,81.15 61.87,81.15 60.27,79.55 60.27,79.02 U1.28 | v75.97,74.37 v74.75,75.59
  Bottom 0.152: v84.05,42.9 v78.94,42.9 75.97,45.87 v75.97,74.37 | v69.11,81.15 70.64,81.15 72.39,79.4 72.39,77.95 v74.75,75.59 | v44.42,43.13 46.18,43.13 46.41,42.9 v52.73,42.9
M_3  (via drill 0.35)
  Top 0.152: v25.68,24.08 20.88,24.08 D10.1 | v33.68,23.85 34.06,23.47 39.24,23.47 39.85,24.08 D9.1 40.51,23.45 44.1,23.45 v44.73,24.08 | D6.1 97,24.08 85.95,24.08 85.72,23.85 78.26,23.85 78.03,24.08 D7.1 77.95,24.08 77.72,23.85 65.46,23.85 65.23,24.08 58.98,24.08 D8.1 58.9,24.16 v57.99,25.07 57.99,24.99 56.84,23.85 v52.73,23.85 | v62.26,76.66 62.79,77.19 62.79,78.94 U1.30
  Bottom 0.152: v25.68,24.08 27.13,24.08 27.36,23.85 v33.68,23.85 | v62.26,76.66 61.59,76 61.59,72.11 54.76,65.28 54.76,52.3 57.99,49.07 v57.99,25.07 | v44.73,24.08 46.18,24.08 46.41,23.85 v52.73,23.85
M_4  (via drill 0.35)
  Top 0.152: v26.06,5.03 20.88,5.03 D1.1 | v38.94,4.8 39.62,4.8 39.85,5.03 D2.1 | D3.1 58.98,5.03 v61.72,5.03 65.23,5.03 65.46,4.8 77.72,4.8 77.95,5.03 D4.1 78.03,5.03 78.26,4.8 85.72,4.8 85.95,5.03 97,5.03 D5.1 | v64.01,75.13 64.01,78.94 U1.31
  Bottom 0.152: v26.06,5.03 27.13,5.03 27.36,4.8 v38.94,4.8 61.49,4.8 v61.72,5.03 61.72,54.41 61.65,54.48 61.65,69.34 63.63,71.32 63.63,74.75 v64.01,75.13
M_A  (via drill 0.35)
  Top 0.152: R4.1 15.32,2.06 16,2.06 21.49,7.54 21.49,9.3 21.26,9.53 15.85,9.53 15.24,8.91 U$1.SW1 | v65.66,75.13 66.6,76.07 66.6,78.94 U1.33 | v62.26,61.34 59.66,61.34 59.44,61.11 20.12,61.11 v16.76,64.47
  Bottom 0.152: U$1.SW1 15.24,8.91 14.94,9.22 14.94,12.93 15.24,13.23 U$6.SW1 15.24,29.31 14.94,29.62 14.94,46.63 15.24,46.94 U$11.SW1 15.24,48.36 14.94,48.67 14.94,62.71 16.69,64.47 v16.76,64.47 15.24,65.99 U$16.SW1 | v65.66,75.13 65.28,74.75 65.28,72.52 61.95,69.19 61.95,61.65 v62.26,61.34
M_B
  Top 0.152: U1.36 70.41,78.94 70.41,76.58 68.28,74.45 68.28,72.69 68.05,72.47 61.42,72.47 61.04,72.85 51.21,72.85 50.06,71.7 40.84,71.7 35.2,66.06 34.29,66.06 U$17.SW1 | R5.1 34.37,2.06 35.05,2.06 40.54,7.54 40.54,9.3 40.31,9.53 34.9,9.53 34.29,8.91 U$2.SW1
  Bottom 0.152: U$2.SW1 34.29,8.91 33.98,9.22 33.98,14.2 34.29,14.5 U$7.SW1 34.29,27.96 33.98,28.27 33.98,34.14 34.29,34.44 U$12.SW1 34.29,47.02 33.98,47.32 33.98,51.54 34.29,51.84 U$17.SW1
M_C  (via drill 0.35)
  Top 0.152: v69.88,75.13 71.63,76.89 71.63,78.94 U1.37 | v66.24,71.5 65.99,71.25 59.44,71.25 54.25,66.06 53.34,66.06 U$18.SW1 | R6.1 53.42,2.06 53.8,2.06 59.13,7.39 59.44,7.39 59.59,7.54 59.59,9.3 59.36,9.53 53.95,9.53 53.34,8.91 U$3.SW1
  Bottom 0.152: v66.24,71.5 v69.88,75.13 | U$3.SW1 53.34,8.91 53.03,9.22 53.03,13.18 53.34,13.49 U$8.SW1 53.34,27.96 53.03,28.27 53.03,32.87 53.34,33.17 U$13.SW1 53.34,47.02 52.91,47.45 52.91,51.03 54.36,52.48 54.36,65.02 U$18.SW1
M_D  (via drill 0.35)
  Top 0.152: v72.47,85.27 72.47,87.33 68.2,91.59 64.01,91.59 61.49,94.11 61.49,95.94 U1.10 | v74.75,78.11 74.75,76.81 v72.08,74.14 | v73.69,2.59 73.15,2.06 72.47,2.06 R7.1
  Bottom 0.152: v72.47,85.27 72.47,84.35 73.61,83.21 73.61,79.25 v74.75,78.11 | v72.08,74.14 72.08,66.37 72.39,66.06 U$19.SW1 72.39,50.95 72.08,50.65 72.08,47.32 72.39,47.02 U$14.SW1 72.39,32.79 71.96,32.36 71.96,28.4 72.39,27.96 U$9.SW1 72.39,13.61 72.08,13.31 72.08,9.22 72.39,8.91 U$4.SW1 72.39,8.84 73.69,7.54 v73.69,2.59
M_E  (via drill 0.35)
  Top 0.152: R8.1 88.39,2.06 95.63,2.06 97.69,4.12 97.69,9.3 97.46,9.53 92.05,9.53 91.44,8.91 U$5.SW1 | v71.55,85.27 71.55,87.78 68.05,91.29 63.86,91.29 60.27,94.87 60.27,95.94 U1.11
  Bottom 0.152: U$5.SW1 91.44,8.91 91.14,9.22 91.14,14.96 91.44,15.27 U$10.SW1 91.44,29.44 90.75,30.12 90.75,38.86 90.45,39.17 90.45,45.95 91.44,46.94 U$15.SW1 91.44,48.62 90.98,49.07 90.98,65.46 U$20.SW1 91.44,65.99 90.91,65.46 86.33,65.46 84.51,67.28 84.51,68.81 83.21,70.1 81.84,70.1 73.13,78.82 73.13,83.24 71.55,84.81 v71.55,85.27
N$1  (via drill 0.35)
  Top 0.152: v29.46,93.23 29.59,93.36 U$21.3 | v24.13,95.12 24.13,95.63 23.5,96.27 R1.1
  Bottom 0.152: v29.46,93.23 29.12,92.89 26.49,92.89 24.51,94.87 24.38,94.87 v24.13,95.12
N$2  (via drill 0.35)
  Top 0.152: v29.72,83.13 29.11,83.74 28.27,83.74 U2.29 | v13.49,77.5 13.36,77.62 7.85,77.62 4.01,73.79 v4.01,72.14 | v2.36,92.81 17.68,92.81 21.11,96.24 R1.2
  Bottom 0.152: v29.72,83.13 29.72,82.98 30.18,82.53 30.18,80.62 26.67,77.11 13.87,77.11 v13.49,77.5 | v4.01,72.14 4.01,73.86 1.17,76.71 1.17,91.62 v2.36,92.81
N$3  (via drill 0.35)
  Top 0.152: v29.57,82.22 28.8,82.98 28.27,82.98 U2.30 | v24.31,91.52 24,91.52 23.77,91.29 22.17,91.29 21.18,92.28 R2.2
  Bottom 0.152: v29.57,82.22 29.57,80.47 29.03,79.93 28.42,79.93 28.12,80.24 28.12,82.98 28.19,83.06 28.19,86.79 24.31,90.68 v24.31,91.52
N$4  (via drill 0.35)
  Top 0.152: v45.72,91.31 45.34,91.31 44.2,92.46 42.16,92.46 41.54,93.08 U$22.2
  Bottom 0.152: v45.72,91.31 45.97,91.06 45.97,89.28 45.34,88.65 44.17,88.65 U$23.6
N$5  (via drill 0.35)
  Top 0.152: U$21.2 30.24,92.72 29.84,92.33 v29.84,92.2 | v24.51,92.46 23.18,92.46 R2.1
  Bottom 0.152: v29.84,92.2 29.72,92.2 29.34,92.58 24.64,92.58 v24.51,92.46
N$6  (via drill 0.35)
  Top 0.152: v42.29,91.82 40.89,93.22 U$22.3
  Bottom 0.152: v42.29,91.82 42.55,92.08 45.85,92.08 46.35,91.57 46.35,89.15 44.83,87.63 U$23.5
N$7  (via drill 0.35)
  Top 0.152: Q2.1 20.27,80.47 20.27,78.11 20.34,78.03 C6.1 20.27,78.03 19.51,78.03 v19.2,77.72 | v27.05,79.32 27.36,79.02 29.95,79.02 30.33,79.4 30.33,80.01 U2.2
  Bottom 0.152: v27.05,79.32 25.98,79.32 24.23,77.57 19.2,77.57 | 19.2,77.57 14.33,77.57 13.79,78.11 13.18,78.11 12.88,77.8 12.88,77.19 15.77,74.3 Q1.1 | 19.2,77.57 v19.2,77.72
N$8
  Top 0.152: U3.1 12.42,15.93 19.58,15.93 19.81,15.7 28.19,15.7 29.49,16.99 U4.3
N$9
  Top 0.152: U4.1 31.61,15.75 47.3,15.75 48.54,16.99 U5.3
N$10
  Top 0.152: U5.1 50.66,15.75 65.13,15.75 66.37,16.99 67.59,16.99 U6.3
N$11
  Top 0.152: U6.1 69.57,16 84.43,16 85.5,17.07 86.64,17.07 U7.3
N$12
  Top 0.152: U7.1 88.54,16 87.33,17.22 87.33,17.53 86.03,18.82 22.78,18.82 21.64,19.96 9.68,19.96 4.8,24.84 4.8,31.09 9.75,36.04 10.44,36.04 U8.3
N$13
  Top 0.152: U8.1 12.56,34.8 28.25,34.8 29.49,36.04 U9.3
N$14
  Top 0.152: U9.1 31.47,35.05 35.94,35.05 38.1,37.21 47.45,37.21 48.54,36.12 U10.3
N$15
  Top 0.152: U10.1 50.52,35.05 51.13,35.05 51.49,35.41 66.64,35.41 67.43,36.11 U11.3
N$16
  Top 0.152: U11.1 69.71,34.8 84.18,34.8 85.42,36.04 86.64,36.04 U12.3
N$17  (via drill 0.35)
  Top 0.152: v48.77,37.87 86.03,37.87 87.33,36.58 87.33,36.27 88.54,35.05 U12.1 | v34.9,55.09 32.54,55.09 31.39,56.24 11.58,56.24 U13.3
  Bottom 0.152: v48.77,37.87 38.12,48.51 38.12,49.84 34.9,53.06 v34.9,55.09
N$18
  Top 0.152: U13.1 12.56,53.85 23.37,53.85 23.93,54.41 28.8,54.41 29.49,55.09 U14.3
N$19
  Top 0.152: U14.1 31.75,53.9 45.41,53.9 45.97,54.46 47.57,54.46 48.36,55.16 U15.3
N$20
  Top 0.152: U16.3 66.51,55.16 62.66,51.31 57.48,51.31 54.76,54.03 50.52,54.03 U15.1
N$21
  Top 0.152: U16.1 69.71,53.85 80.39,53.85 81,54.46 84.77,54.46 85.56,55.16 U17.3
N$22
  Top 0.152: U17.1 88.54,54.1 87.33,55.32 87.33,55.63 86.26,56.69 67.82,56.69 66.9,57.61 10.13,57.61 4.8,62.94 4.8,69.19 9.75,74.14 10.44,74.14 U18.3
N$23
  Top 0.152: U18.1 12.56,72.9 28.25,72.9 29.49,74.14 U19.3
N$24
  Top 0.152: U19.1 31.61,72.9 38.08,72.9 39.09,73.91 40.69,73.91 41.6,74.83 42.24,74.83 43.61,73.46 47.61,73.46 48.36,74.21 U20.3
N$25
  Top 0.152: U20.1 50.52,73.15 65.84,73.15 66.83,74.14 67.59,74.14 U21.3
N$26
  Top 0.152: U21.1 69.57,73.08 76.2,73.08 77.19,74.07 86.56,74.07 86.64,74.14 U22.3
N$27  (via drill 0.35)
  Top 0.152: R27.2 20.66,19.43 17.83,19.43 v17.45,19.05 17.07,19.43 11.51,19.43 v11.12,19.05 | 6.51,18.86 5.11,20.27 TP10.TP | 6.51,18.86 8.31,17.07 10.44,17.07 U3.3 | v6.55,18.9 6.51,18.86
  Bottom 0.152: v17.45,19.05 17.3,18.9 17.3,17.98 Q4.3 | v6.55,18.9 7.62,17.83 TP9.TP 7.62,17.91 8.76,19.05 v11.12,19.05
N$28
  Bottom 0.152: R24.1 IC1.2
N$29
  Bottom 0.152: LED1.C 19.43,97 18.14,95.71 18.14,90.63 16.61,89.1 16.61,88.24 17.22,87.63 20.73,87.63 21.18,88.09 22.4,88.09 23.24,88.92 IC1.7
N$30
  Bottom 0.152: R25.2 LED1.A
N$31
  Bottom 0.152: LED2.C 22.71,97.54 22.71,97 21.87,96.16 21.87,89.08 21.95,89 IC1.6
N$32
  Bottom 0.152: LED2.A 22.78,95.4 22.78,93.57 22.94,93.42 R26.2
N$33  (via drill 0.35)
  Top 0.152: v92.58,73.15 88.62,73.15 U22.1
  Bottom 0.152: v92.58,73.15 93.5,73.15 93.95,73.61 TP12.TP
N$34
  Bottom 0.279: Q3.3 38.4,91.47 39.75,92.82 44.82,92.82 44.83,92.84 47.88,92.84 49.57,94.52 S4.3
N$35
  Bottom 0.152: R20.1 89.61,95.4 90.91,95.4 91.9,96.39 93.5,96.39 94.49,95.4 R16.1 94.56,95.4 95.56,96.39 S2.B
N$36
  Bottom 0.152: 96.32,90.45 97.16,91.29 S2.A | 96.32,90.45 95.25,89.38 95.25,88.01 R15.1 | 96.32,90.45 94.49,92.28 R19.2
N$37
  Bottom 0.152: R17.1 9.98,95.25 10.97,94.26 12.65,94.26 R14.1 13.72,95.25 14.86,96.39 S1.B
N$38
  Bottom 0.152: 15.44,92.05 16.08,92.05 16.76,91.36 S1.A | 15.44,92.05 14.05,92.05 R18.2 | 15.44,92.05 15.44,86.49 R13.1
N$68
  Top 0.152: D1.2 20.8,8.38 18.06,8.38 16.08,6.4 8.91,6.4 U$1.SW2
N$69
  Top 0.152: D2.2 39.88,8.69 39.55,9.02 36.6,9.02 33.98,6.4 27.96,6.4 U$2.SW2
N$70
  Top 0.152: D3.2 58.9,8.38 56.54,8.38 54.56,6.4 47.02,6.4 U$3.SW2
N$71
  Top 0.152: D4.2 77.95,8.38 74.07,8.38 72.08,6.4 66.06,6.4 U$4.SW2
N$72
  Top 0.152: D5.2 97,8.38 94,8.38 92.02,6.4 85.11,6.4 U$5.SW2
N$73
  Top 0.152: D6.2 97,27.43 93.12,27.43 91.14,25.45 85.11,25.45 U$10.SW2
N$74
  Top 0.152: D15.2 97,46.48 93.12,46.48 91.14,44.5 85.11,44.5 U$15.SW2
N$75
  Top 0.152: D7.2 77.95,27.43 74.07,27.43 72.08,25.45 66.06,25.45 U$9.SW2
N$76
  Top 0.152: D8.2 58.9,27.43 55.02,27.43 53.03,25.45 47.02,25.45 U$8.SW2
N$77
  Top 0.152: D13.2 58.9,46.48 55.4,46.48 53.42,44.5 47.02,44.5 U$13.SW2
N$78
  Top 0.152: D14.2 77.95,46.48 74.07,46.48 72.08,44.5 66.06,44.5 U$14.SW2
N$79
  Top 0.152: D9.2 39.85,27.43 35.97,27.43 33.98,25.45 27.96,25.45 U$7.SW2
N$80
  Top 0.152: D10.2 20.8,27.43 16.92,27.43 14.94,25.45 8.91,25.45 U$6.SW2
N$81
  Top 0.152: D11.2 20.8,46.48 16.92,46.48 14.94,44.5 8.91,44.5 U$11.SW2
N$82
  Top 0.152: D12.2 39.85,46.48 35.97,46.48 33.98,44.5 27.96,44.5 U$12.SW2
N$83
  Top 0.152: D20.2 20.8,65.53 16.92,65.53 14.94,63.55 8.91,63.55 U$16.SW2
N$84
  Top 0.152: D19.2 39.85,65.53 35.97,65.53 33.98,63.55 27.96,63.55 U$17.SW2
N$85
  Top 0.152: D18.2 58.9,65.53 57.1,65.53 55.75,64.19 47.33,64.19 U$18.SW2
N$86
  Top 0.152: D17.2 77.95,65.53 74.07,65.53 72.08,63.55 66.06,63.55 U$19.SW2
N$87
  Top 0.152: D16.2 97,65.53 93.12,65.53 91.14,63.55 85.11,63.55 U$20.SW2
N$88  (via drill 0.35)
  Top 0.152: v42.75,81.61 42.75,82.45 41.91,83.29 S3.2 | v53.87,91.14 49.15,91.14 TP1.TP | v69.42,97.54 70.41,96.55 70.41,96.01 U1.3 | v60.73,72.24 61.19,72.24 61.27,72.16 v73.84,72.16 | v59.56,90.42 60.96,91.82 v60.9,91.89
  Bottom 0.152: v42.75,81.61 42.75,77.65 43.51,76.89 43.81,76.89 SJ1.1 43.81,76.81 44.5,76.81 49.07,72.24 v60.73,72.24 | C34.2 70.41,86.64 70.41,89.38 67.3,92.5 R9.1 67.59,92.51 | v53.87,91.14 59.44,91.14 59.56,91.01 v59.56,90.42 59.56,90.04 61.85,87.76 61.85,86.11 62.61,85.34 69.15,85.34 C34.2 | v69.42,97.54 69.8,97.16 69.8,95.63 68.78,94.61 64.59,94.61 61.8,91.82 60.96,91.82 v60.9,91.89 | v73.84,72.16 74.14,72.16 74.45,71.86 75.06,71.86 75.36,72.16 75.36,76.12 72.69,78.79 72.69,83.21 70.48,85.42 70.48,86.56 C34.2
N$90  (via drill 0.35)
  Top 0.152: v33.53,81.69 33.53,80.09 U2.6
  Bottom 0.152: v33.53,81.69 32.31,82.91 TP4.TP
N$91  (via drill 0.35)
  Top 0.152: v34.44,81.38 34.44,80.09 U2.7
  Bottom 0.152: v34.44,81.38 34.44,82.68 34.67,82.91 TP5.TP
N$100
  Top 0.152: U2.9 36.58,81.38 39.47,81.38 41.6,79.25 TP8.TP
N$101
  Top 0.152: U2.8 35.2,80.01 37.8,80.01 38.56,79.25 TP7.TP
RGB_OUT  (via drill 0.35)
  Top 0.152: v19.51,12.42 20.8,12.42 R28.2 | v43.74,75.13 v48.46,75.13 | U1.16 55.47,91.9 56.01,91.9 56.87,91.03 56.87,86.08 v57.23,85.72 | v52.7,76.96 52.7,78.87 54.3,80.47 56.82,80.47 57.25,80.9 57.78,80.9 v59.44,82.55
  Bottom 0.152: v19.51,12.42 16.38,15.54 Q4.2 16.38,15.62 18.06,17.3 18.06,56.41 27.1,65.46 27.1,69.75 29.06,71.7 40.31,71.7 v43.74,75.13 | v48.46,75.13 48.84,75.13 50.29,76.58 52.32,76.58 v52.7,76.96 | v59.44,82.55 60.33,83.44 60.33,84.33 59.05,85.6 57.35,85.6 v57.23,85.72
SENS_VP  (via drill 0.35)
  Top 0.152: 57.57,92.93 56.54,93.95 52.88,93.95 51.36,92.43 48.69,92.43 47.4,91.14 47.4,88.7 45.8,87.1 45.49,87.1 R22.2 | 57.57,92.93 57.86,92.63 57.86,82.4 56.54,81.08 54.33,81.08 52.65,82.75 48.84,82.75 48.77,82.68 45.49,82.68 R21.1 | v68.12,97.54 69.11,96.55 69.11,96.01 U1.4 | v59.13,92.96 58.88,93.22 57.86,93.22 57.57,92.93
  Bottom 0.152: v68.12,97.54 67.87,97.79 63.96,97.79 v59.13,92.96
VBAT  (via drill 0.35)
  Top 0.279: v21.57,97.92 23.24,97.92 24,97.16 24,96.37 24.82,95.56 24.82,94.28 26.36,92.73 27.2,92.73 29.41,90.53 32.4,90.53 35.35,93.47 v35.81,93.47 | v6.63,85.04 10.59,85.04 13.72,88.16 16.84,88.16 v17.22,88.54 | v50.67,94.87 49.91,94.11 47.75,94.11 v47.24,93.6
  Bottom 0.279: v21.57,97.92 21.57,96.39 20.73,95.56 20.73,89 IC1.5 20.57,88.92 20.27,88.62 18.59,88.62 C39.1 18.44,88.54 v17.22,88.54 | v6.63,85.04 4.04,82.45 4.04,78.03 5.03,77.04 5.03,74.98 TP13.TP | S4.2 52.57,95.43 51.69,94.55 50.99,94.55 v50.67,94.87 | v47.24,93.6 46.91,93.27 44.65,93.27 44.64,93.26 39.53,93.26 38.86,92.58 37.59,92.58 36.7,93.47 v35.81,93.47
VBUS  (via drill 0.35)
  Top 0.279: U$21.1 30.94,94.74 30.94,92.2 v31.93,91.21 | v45.26,90.45 45.87,90.45 46.41,90.98 46.41,91.64 45.15,92.9 42.48,92.9 42.19,93.19 U$22.1 | v20.04,90.3 v22.48,90.3 22.66,90.47 27.69,90.47 27.96,90.19 v27.96,90.07
  Bottom 0.279: 38.1,87.48 38.1,89.31 Q3.1 38.18,89.38 39.62,90.83 44.88,90.83 v45.26,90.45 | 38.1,87.48 D21.2 | 38.1,87.48 36.58,85.95 34.98,85.95 34.75,86.18 34.75,86.87 33.83,87.78 33.83,89.61 SJ3.1 33.68,89.69 33.45,89.69 v31.93,91.21 31.22,90.5 28.4,90.5 v27.96,90.07 | R25.1 19.43,90.91 v20.04,90.3 | R26.1 22.94,91.44 22.48,90.98 v22.48,90.3 22.55,90.22 23.47,90.22 24.61,89.08 IC1.8 | IC1.4 20.73,83.52 20.73,83.67 21.8,84.74 24.43,84.74 24.61,84.93 24.61,88.85 24.54,88.92 IC1.8 | R23.2 20.5,80.77 22.17,79.1 22.17,78.18 22.4,77.95 24.08,77.95 27.74,81.61 27.74,83.13 27.81,83.21 27.81,84.12 27.1,84.84 26.8,84.84 26.42,85.22 26.42,87.08 IC1.8
VSUP  (via drill 0.35)
  Top 0.279: 67.59,53.42 67.59,53.03 65.15,50.6 65.15,45.8 64.47,45.11 64.47,43.13 67.59,40.01 C19.1 67.63,41.59 v67.82,41.78 | 67.59,53.42 67.59,54.03 | 67.59,54.03 U16.4 | 85.8,54.03 81.23,54.03 80.62,53.42 67.59,53.42 | 85.8,54.03 86.64,54.03 U17.4 | 89.53,40.92 89.53,34.82 89.08,34.37 88.01,34.37 87.4,34.98 86.72,34.98 U12.4 86.64,34.9 84.81,34.9 84.28,34.37 68.28,34.37 67.74,34.9 U11.4 67.59,34.98 66.8,34.98 | 89.53,40.92 89.38,41.07 87.78,41.07 86.72,40.01 C20.1 | 89.53,40.92 91.29,42.67 94.18,42.67 94.87,41.99 97.54,41.99 97.77,42.22 97.77,51.74 89.38,60.12 87.78,60.12 86.72,59.05 C25.1 86.56,58.98 85.8,58.22 v85.8,57.76 | v85.8,16.46 86.26,16 86.64,16 U7.4 | C15.1 86.64,20.95 v85.57,19.89 83.44,22.02 68.73,22.02 67.67,20.95 C14.1 67.51,21.03 52.27,21.03 51.28,22.02 49.68,22.02 48.69,21.03 C13.1 | 48.54,34.37 48.54,33.98 46.1,31.55 46.1,26.75 45.41,26.06 45.41,24.08 45.57,23.93 | 48.54,34.37 48.54,34.98 U10.4 | 45.57,23.93 48.54,20.95 C13.1 | 66.8,34.98 51.59,34.98 50.98,34.37 48.54,34.37 | 45.57,23.93 44.58,22.94 31.55,22.94 29.57,20.95 C12.1 | v85.8,54.48 85.8,54.03 | 10.82,16.31 10.9,16.38 10.97,16.38 11.66,17.07 11.66,17.53 | 10.82,16.31 10.52,16 U3.4 | 11.66,17.53 11.89,17.75 19.56,17.75 20.23,17.08 R27.1 | 10.82,16.31 11.81,15.32 28.35,15.32 28.96,15.93 29.49,15.93 U4.4 29.64,15.85 30.18,15.32 47.37,15.32 | 47.37,15.32 47.4,15.32 48.01,15.93 48.54,15.93 U5.4 48.69,15.85 49.23,15.32 65.23,15.32 65.84,15.93 67.59,15.93 U6.4 | 10.69,35.23 10.9,35.43 10.97,35.43 11.2,35.66 11.2,36.8 | 10.69,35.23 10.52,35.05 U8.4 10.52,34.98 8.23,32.69 8.23,29.72 7.19,28.68 7.19,24.38 8.8,22.77
  Top 0.279: 11.2,36.8 11.2,39.32 10.52,40.01 C16.1 | 10.44,54.03 U13.4 10.05,53.59 v9.4,53.59 | C16.1 10.36,40.08 7.32,43.13 7.32,45.11 8,45.8 8,56.46 4.42,60.05 4.42,69.34 9.98,74.91 11.43,74.91 11.66,74.68 | 10.69,35.23 11.63,34.29 16.89,34.29 18.23,32.95 C40.1 26.22,32.95 27.64,34.37 28.35,34.37 28.96,34.98 29.49,34.98 U9.4 | 29.49,54.03 U14.4 29.64,53.95 29.18,53.95 v28.45,53.21 | 48.54,54.03 48.56,54.03 | 48.56,54.03 U15.4 | 8.8,22.77 10.44,21.13 10.44,20.95 C11.1 | C17.1 14.25,40.01 13.18,41.07 11.58,41.07 10.59,40.08 C16.1 | C18.1 48.54,40.01 42.82,45.72 42.82,53.42 46.18,53.42 v46.48,53.72 | 11.66,17.53 9.6,19.58 9.53,19.58 4.78,24.33 | 4.78,24.33 4.42,24.69 4.42,31.24 9.98,36.8 11.2,36.8 | v66.75,73.15 67.59,73.15 U21.4 | v65.46,81.76 67.97,81.76 68.96,82.75 69.57,82.75 70.33,81.99 v70.33,80.54 | C30.1 86.72,78.18 87.4,77.5 87.4,73.76 87.17,73.53 87.1,73.53 86.72,73.15 U22.4 86.46,73.11 85.99,73.58 78.47,73.58 C29.1 | v74.75,72.47 77.34,72.47 77.88,73 C29.1 | 41.91,80.92 43.51,80.92 46.41,78.03 46.79,78.03 C28.1 | 41.91,80.92 40.69,82.14 40.69,85.67 39.43,86.93 | v37.11,87.86 38.51,87.86 39.43,86.93 | 41.91,73.08 39.93,73.08 C27.1 39.85,72.92 39.4,72.47 30.86,72.47 30.25,73.08 29.57,73.08 U19.4 29.49,73 28.88,73 28.35,72.47 11.81,72.47 10.82,73.46 | 41.91,73.08 48.54,73.08 U20.4 | 10.82,73.46 10.9,73.53 10.97,73.53 11.66,74.22 11.66,74.68 | 10.82,73.46 10.52,73.15 U18.4 9.91,73.11 8.23,71.42 8.23,66.67 7.32,65.76 7.32,62.87 10.32,59.85 | 11.66,74.68 15.47,78.49 C26.1 | 10.44,59.74 10.44,59.05 C21.1 | 10.32,59.85 10.44,59.74 | C22.1 14.25,59.05 13.18,60.12 10.82,60.12 10.44,59.74
  Top 0.279: C22.1 29.64,59.13 30.63,60.12 32.23,60.12 33.3,59.05 v45.47,59.05 45.97,59.56 v47.12,59.56 48.07,59.56 C23.1 48.69,59.13 49.68,60.12 51.28,60.12 52.35,59.05 C24.1 | 41.91,73.08 v41.91,74.22 | v41.91,80.77 41.91,80.92 | 78.72,61.27 78.72,73 C29.1 | 78.72,61.27 77.57,60.12 68.73,60.12 67.74,59.13 C24.1 | 78.72,61.27 v82.14,57.84 | R21.2 44.39,84.52 41.91,87 v41.91,87.25 | v40.24,87.1 40.07,86.93 39.43,86.93 | 10.32,59.85 9.23,59.85 v9.14,59.94 | C22.1 29.21,59.05 v28.32,59.94 | v47.75,53.34 48.45,54.03 48.56,54.03 | C13.1 48.45,20.83 v47.24,20.83 | v46.61,14.35 47.37,15.11 47.37,15.32 | v66.48,33.85 66.48,34.66 66.8,34.98 | C24.1 67.44,59.05 v66.42,60.07 | v66.42,53.34 67.11,54.03 67.59,54.03 | 8.8,22.77 9.56,22.77 v10.41,23.62 | v4.19,23.11 4.78,23.7 4.78,24.33
  Bottom 0.279: v85.8,16.46 85.8,19.66 v85.57,19.89 | v85.8,54.48 v85.8,57.76 85.72,57.84 v82.14,57.84 | v66.75,73.15 66.75,76.81 66.67,76.89 C32.1 | IC2.3 63.63,76.96 66.6,76.96 C32.1 | v65.46,81.76 63.63,79.93 63.63,78.94 IC2.1 | 68.5,78.72 66.75,76.96 C32.1 | 68.5,78.72 v70.33,80.54 | v74.75,72.47 68.5,78.72 | 36.12,87.86 36.12,87.25 35.74,86.87 D21.1 | 36.12,87.86 36.12,89.31 Q3.2 36.04,89.46 34.37,91.14 33.83,91.14 SJ3.2 | 36.12,87.86 v37.11,87.86 | v41.91,74.22 v41.91,80.77 | v41.91,87.25 40.39,87.25 v40.24,87.1 | v9.14,59.94 9.14,53.85 v9.4,53.59 | v28.32,59.94 27.94,59.56 27.94,53.59 28.32,53.21 v28.45,53.21 | v46.48,53.72 46.48,58.55 45.97,59.05 v45.47,59.05 | v47.12,59.56 47.5,59.18 47.5,54.36 48.01,53.85 48.01,53.59 v47.75,53.34 | v47.24,20.83 46.1,19.68 46.1,14.86 v46.61,14.35 | v67.82,41.78 67.82,35.05 66.55,33.78 v66.48,33.85 | v66.42,60.07 v66.42,53.34 | v10.41,23.62 4.95,23.62 4.32,22.99 v4.19,23.11
XTAL1  (via drill 0.35)
  Top 0.152: Q2.3 22.4,82.14 22.4,83.59 21.34,84.66 C5.1 21.34,84.73 21.34,87.78 23.01,89.46 v26.44,89.46 | v28.73,80.54 29.18,80.09 29.57,80.09 U2.1
  Bottom 0.152: v28.73,80.54 28.73,83.06 29.79,84.12 | 29.79,84.12 35.2,84.12 35.89,83.44 35.89,78.64 32.18,74.93 27.56,74.93 Q1.2 | v26.44,89.46 26.44,88.97 28.5,86.92 28.5,85.42 29.79,84.12

## Text on the board
bNames: B+ | B-